# Altium schematic sheet POWER.SchDoc
size A4; ApprovedBy: Mateusz Kowalik; CheckedBy: Mateusz Kowalik; Author: Mateusz Kowalik; CompanyName: InMotion Labs sp. z o.o.; DrawnBy: Mateusz Kowalik; Engineer: Mateusz Kowalik; Organization: InMotion Labs sp. z o.o.; Address1: Rydlówka 5A; Address2: 30-363 Kraków; Address4: Poland; DocumentNumber: 5; Revision: Rev 0; SheetNumber: 4; SheetTotal: 17
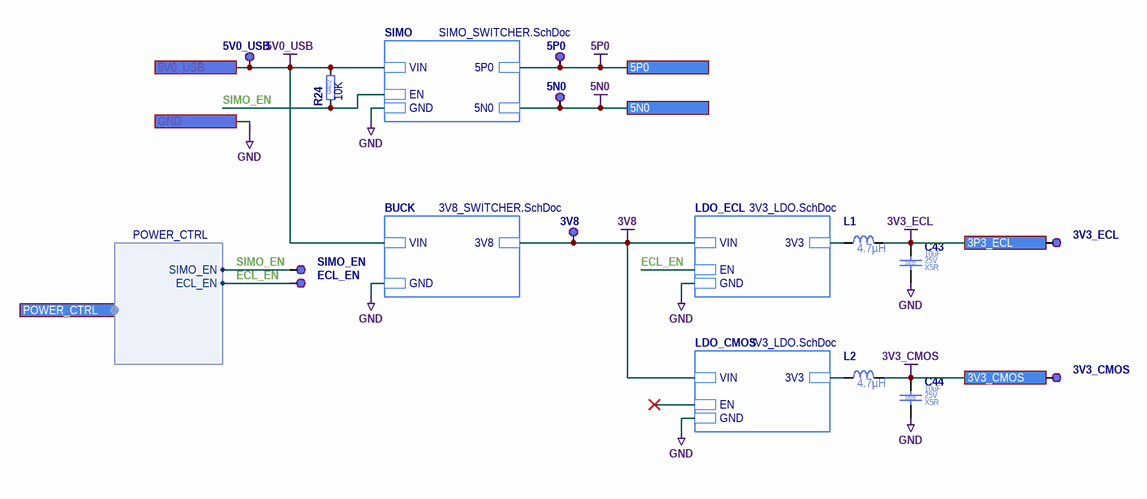
[diagram p0: POWER.SchDoc]

## Parts
3V3_CMOS  TP_PAD_1.3MM  [TP_PAD_1.3MM]  (value not drawn)  (no BOM)
3V3_ECL  TP_PAD_1.3MM  [TP_PAD_1.3MM]  (value not drawn)  (no BOM)
3V8  TP_PAD_1.3MM  [TP_PAD_1.3MM]  (value not drawn)  (no BOM)
5N0  TP_PAD_1.3MM  [TP_PAD_1.3MM]  (value not drawn)  (no BOM)
5P0  TP_PAD_1.3MM  [TP_PAD_1.3MM]  (value not drawn)  (no BOM)
5V0_USB  TP_PAD_1.3MM  [TP_PAD_1.3MM]  (value not drawn)  (no BOM)
C43  Case/Package: 0805  Voltage Rating (DC): 25V  Dielectric: X5R  Capacitance: 10uF  [C_0805_2012]  (hidden comment: C_10UF_25V_X5R_0805_10)
C44  Case/Package: 0805  Voltage Rating (DC): 25V  Dielectric: X5R  Capacitance: 10uF  [C_0805_2012]  (hidden comment: C_10UF_25V_X5R_0805_10)
ECL_EN  TP_PAD_1.3MM  [TP_PAD_1.3MM]  (value not drawn)  (no BOM)
L1  Inductance: 4.7µH  [L_1008_2520]  (hidden comment: 1239AS-H-4R7M=P2)
L2  Inductance: 4.7µH  [L_1008_2520]  (hidden comment: 1239AS-H-4R7M=P2)
R24  Resistance: 10K  Case/Package: 0402  [R_0402_1005]  (hidden comment: R_10K_0402_1)
SIMO_EN  TP_PAD_1.3MM  [TP_PAD_1.3MM]  (value not drawn)  (no BOM)

## Sub-sheets
BUCK = 3V8_SWITCHER.SchDoc: 3V8, GND, VIN
LDO_CMOS = 3V3_LDO.SchDoc: 3V3, GND, VIN, EN
LDO_ECL = 3V3_LDO.SchDoc: 3V3, GND, VIN, EN
SIMO = SIMO_SWITCHER.SchDoc: 5P0, GND, VIN, 5N0, EN

## Ports
3P3_ECL, 3V3_CMOS, 5N0, 5P0, 5V0_USB, GND, POWER_CTRL (harness POWER_CTRL)

## Harnesses
POWER_CTRL: SIMO_EN, ECL_EN

## Nets
3V3_CMOS: 3V3_CMOS.1(TP) C44.1 L2.2 ; port 3V3_CMOS
3V3_ECL: 3V3_ECL.1(TP) C43.1 L1.2 ; port 3P3_ECL
3V8: 3V8.1(TP) ; sheet LDO_ECL/VIN, sheet LDO_CMOS/VIN, sheet BUCK/3V8
5N0: 5N0.1(TP) ; port 5N0, sheet SIMO/5N0
5P0: 5P0.1(TP) ; port 5P0, sheet SIMO/5P0
5V0_USB: 5V0_USB.1(TP) R24.2 ; port 5V0_USB, sheet BUCK/VIN, sheet SIMO/VIN
GND: C43.2 C44.2 ; port GND, sheet LDO_ECL/GND, sheet LDO_CMOS/GND, sheet BUCK/GND, sheet SIMO/GND
ECL_EN: ECL_EN.1(TP) ; sheet LDO_ECL/EN, port POWER_CTRL.ECL_EN
SIMO_EN: R24.1 SIMO_EN.1(TP) ; sheet SIMO/EN, port POWER_CTRL.SIMO_EN
NetL1_1: L1.1 ; sheet LDO_ECL/3V3
NetL2_1: L2.1 ; sheet LDO_CMOS/3V3

## Notes on the sheet
- Title
- Size:
- Date:
- A4

## Library data of the parts
3V3_CMOS 3V3_ECL 3V8 5N0 5P0 5V0_USB ECL_EN SIMO_EN = TP_PAD_1.3MM: Testpoint SMD 1.3mm; Part Number: TP_PAD_1.3MM; Case/Package: SMD; Length: 0mm
C43 C44 = C_10UF_25V_X5R_0805_10: Ceramic Capacitor; Manufacturer Part Number: CL21A106KAYNNNE; Manufacturer: Samsung Electro-Mechanics; Value: 10uF; Tolerance: 10%; Part Number: C_10UF_25V_X5R_0805_10; Mount: Surface Mount; Height: 1.35mm; HelpURL: https://pl.mouser.com/datasheet/2/585/MLCC-1837944.pdf; RoHS: Compliant; Max Operating Temperature: 85°C; Status: MK; Supplier 1: Mouser; Supplier Part Number 1: 187-CL21A106KAYNNNE; Supplier 2: LCSC; Supplier Part Number 2: C15850; Manufacturer 2: Samsung Electro-Mechanics; Manufacturer Part Number 2: CL21A106KAYNNNE
L1 L2 = 1239AS-H-4R7M=P2: Power Inductor; Manufacturer: Murata Electronics; Value: 4.7µH; DC Current: 1.5A; Tolerance: 20%; DC Resistance: 240m; Part Number: 1239AS-H-4R7M=P2; Manufacturer Part Number: 1239AS-H-4R7M=P2; Case/Package: DFE252012C; Mount: Surface Mount; Height: 1.2mm; HelpURL: https://pl.mouser.com/datasheet/2/281/product-1023181.pdf; Max Operating Temperature: 85°C; Status: MK; RoHS: Compliant; Supplier 1: Mouser; Supplier Part Number 1: 81-1239AS-H-4R7MP2
R24 = R_10K_0402_1: Thick Film Resistor; Manufacturer: Yageo; Manufacturer Part Number: RC0402FR-7W10KL; Value: 10K; Tolerance: 1%; Voltage Rating (DC): 50V; Power Rating: 63mW; Stats: MK; Part Number: R_10K_0402_1; Mount: Surface Mount; Height: 350um; HelpURL: https://pl.mouser.com/datasheet/2/447/PYu-RC_Group_51_RoHS_L_10-1664068.pdf; RoHS: Compliant; Max Operating Temperature: 155°C; Supplier 1: Mouser; Supplier Part Number 1: 603-RC0402FR-7W10KL; Manufacturer 2: Uniroyal Elec; Manufacturer Part Number 2: 0402WGF1002TCE; Supplier 2: LCSC; Supplier Part Number 2: C25744